# EAGLE design ME433_chip_board (EAGLE 6.5.0)
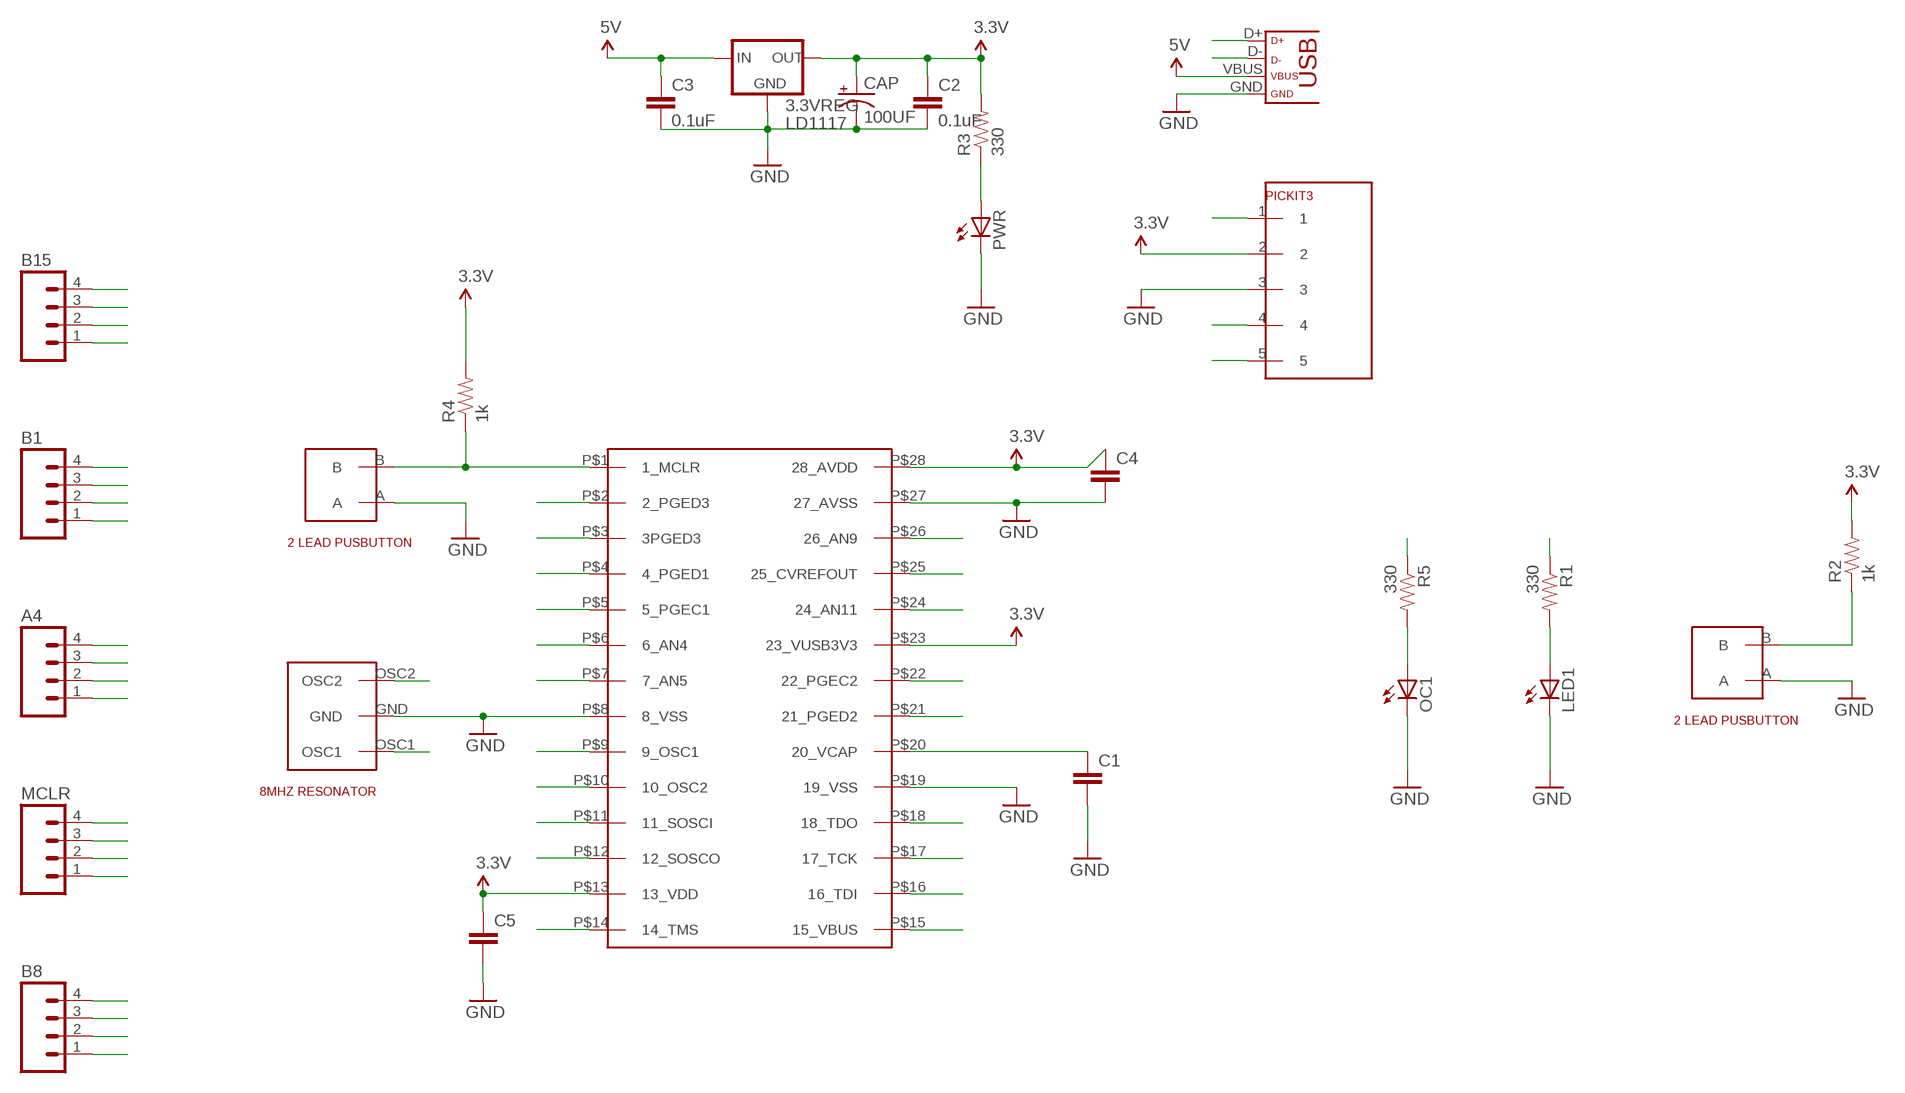
[diagram p0: schematic, sheet 1]

## Parts
3.3VREG  LD1117  [TO220]
A4  M04PTH  [1X04]
B1  M04PTH  [1X04]
B8  M04PTH  [1X04]
B15  M04PTH  [1X04]
C1  CAP0603-CAP  [0603-CAP]
C2  0.1uF  CAP0603-CAP  [0603-CAP]
C3  0.1uF  CAP0603-CAP  [0603-CAP]
C4  CAP0603-CAP  [0603-CAP]
C5  CAP0603-CAP  [0603-CAP]
CAP  100UF  CAP_POL  [CAP_POL_D]
LED1  TLLR4400  [LED3MM]
MCLR  M04PTH  [1X04]
OC1  TLLR4400  [LED3MM]
PICKIT3  1X05_HEADER  [1X05]
PWR  TLLY4400  [LED3MM]
R1  330  RESISTOR0603  [0603-RES]
R2  1k  RESISTOR0603  [0603-RES]
R3  330  RESISTOR0603  [0603-RES]
R4  1k  RESISTOR0603  [0603-RES]
R5  330  RESISTOR0603  [0603-RES]
U$1  PIC32MX250F128B  [PIC32MX250F128B]
U$3  2LEAD_PUSHBUTTON  [2LEAD_PUSHBUTTON]
U$6  8MHZ_RESONATOR  [8MHZ_RESONATOR]
U$7  2LEAD_PUSHBUTTON  [2LEAD_PUSHBUTTON]
USB  USB  [USB-MINIB]

## Nets
3.3V: 3.3VREG.2(OUT) A4.1 C2.1 C4.1 C5.1 CAP.1(+) PICKIT3.2 R2.2 R3.2 R4.2 U$1.P$13(13_VDD) U$1.P$23(23_VUSB3V3) U$1.P$28(28_AVDD)
5V: 3.3VREG.3(IN) B8.1 C3.1 U$1.P$15(15_VBUS) USB.VBUS
A0: B15.3 U$1.P$2(2_PGED3)
A1: B15.2 U$1.P$3(3PGED3)
A4: A4.4 U$1.P$12(12_SOSCO)
B0: B15.1 PICKIT3.4 U$1.P$4(4_PGED1)
B1: B1.4 PICKIT3.5 U$1.P$5(5_PGEC1)
B2: B1.3 U$1.P$6(6_AN4)
B3: B1.2 U$1.P$7(7_AN5)
B4: B1.1 U$1.P$11(11_SOSCI)
B5: A4.3 U$1.P$14(14_TMS)
B7: B8.3 R1.1 U$1.P$16(16_TDI)
B8: B8.4 U$1.P$17(17_TCK)
B9: MCLR.1 U$1.P$18(18_TDO)
B13: MCLR.2 R2.1 U$1.P$24(24_AN11) U$7.B
B14: MCLR.3 U$1.P$25(25_CVREFOUT)
B15: MCLR.4 R5.1 U$1.P$26(26_AN9)
D+: U$1.P$21(21_PGED2) USB.D+
D-: U$1.P$22(22_PGEC2) USB.D-
GND: 3.3VREG.1(GND) A4.2 B8.2 C1.2 C2.2 C3.2 C4.2 C5.2 CAP.2(-) LED1.K(C) OC1.K(C) PICKIT3.3 PWR.K(C) U$1.P$8(8_VSS) U$1.P$19(19_VSS) U$1.P$27(27_AVSS) U$3.A U$6.GND U$7.A USB.GND
MCLR: B15.4 PICKIT3.1 R4.1 U$1.P$1(1_MCLR) U$3.B
N$1: LED1.A R1.2
N$3: OC1.A R5.2
N$4: PWR.A R3.1
N$38: C1.1 U$1.P$20(20_VCAP)
OSC1: U$1.P$9(9_OSC1) U$6.OSC1
OSC2: U$1.P$10(10_OSC2) U$6.OSC2

## Library data of the parts
3.3VREG = ME433:LD1117
A4 B1 B8 B15 MCLR = SparkFun-Connectors:M04: Header 4 Standard 4-pin 0.1" header. Use with straight break away headers (SKU : PRT-00116), right angle break away headers (PRT-00553), swiss pins (PRT-00743), machine pins (PRT-00117), and female headers (PRT-00115). Molex polarized connector foot print use with SKU : PRT-08231 with associated crimp pins and housings. 1MM SMD Version SKU: PRT-10208
C1-C5 = ME433:CAP: Capacitor Standard 0603 ceramic capacitor, and 0.1" leaded capacitor.
CAP = ME433:CAP_POL
LED1 OC1 = ME433:TLLR4400: Low Current (2mA) LED 3 mm Tinted Diffused Package color RED Source: Data sheet <http://www.farnell.com/datasheets/391100.pdf>; MF: VISHAY SEMICONDUCTOR; OC_FARNELL: 1612437
PICKIT3 = ME433:1X05_HEADER
PWR = ME433:TLLY4400: Low Current (2mA) LED 3 mm Tinted Diffused Package color YELLOW Source: Data sheet <http://www.farnell.com/datasheets/391098.pdf>; MF: VISHAY SEMICONDUCTOR; OC_FARNELL: 1612439
R1-R5 = SparkFun-Resistors:RESISTOR: Resistor Basic schematic elements and footprints for 0603, 1206, and PTH resistors.
U$1 = ME433:PIC32MX250F128B
U$3 U$7 = ME433:2LEAD_PUSHBUTTON
U$6 = ME433:8MHZ_RESONATOR
USB = ME433:USB

## Board
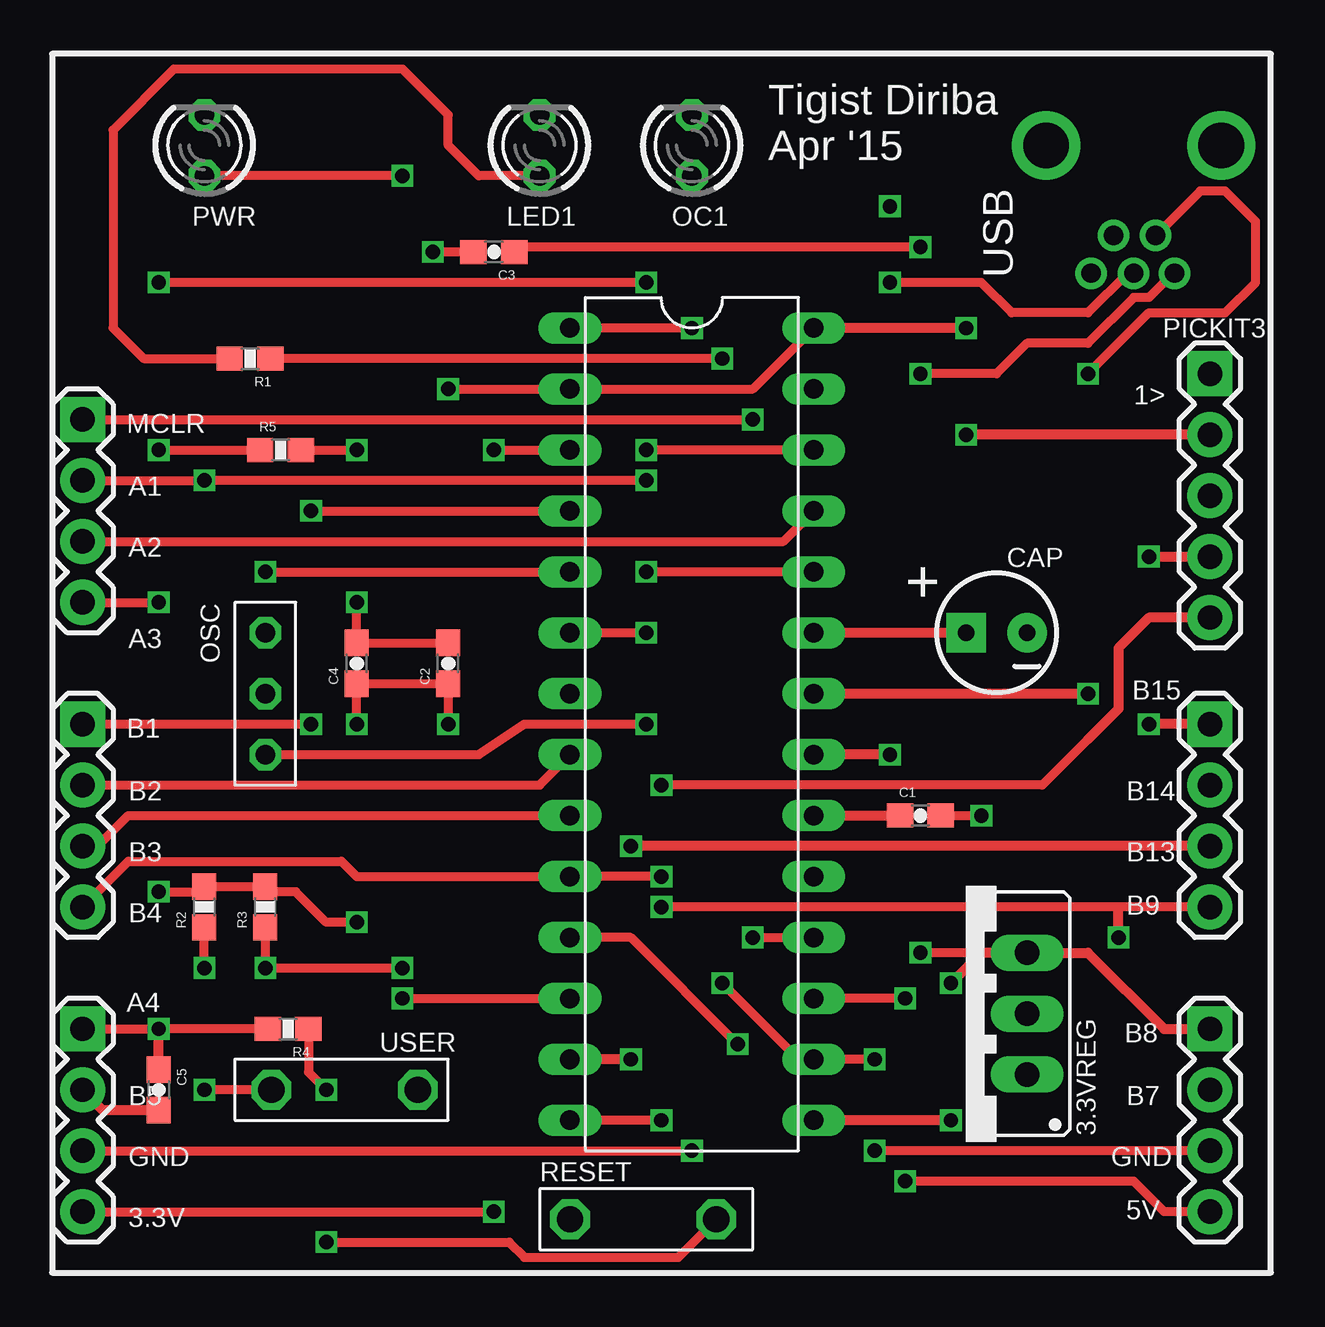
[diagram p1: board, top side]
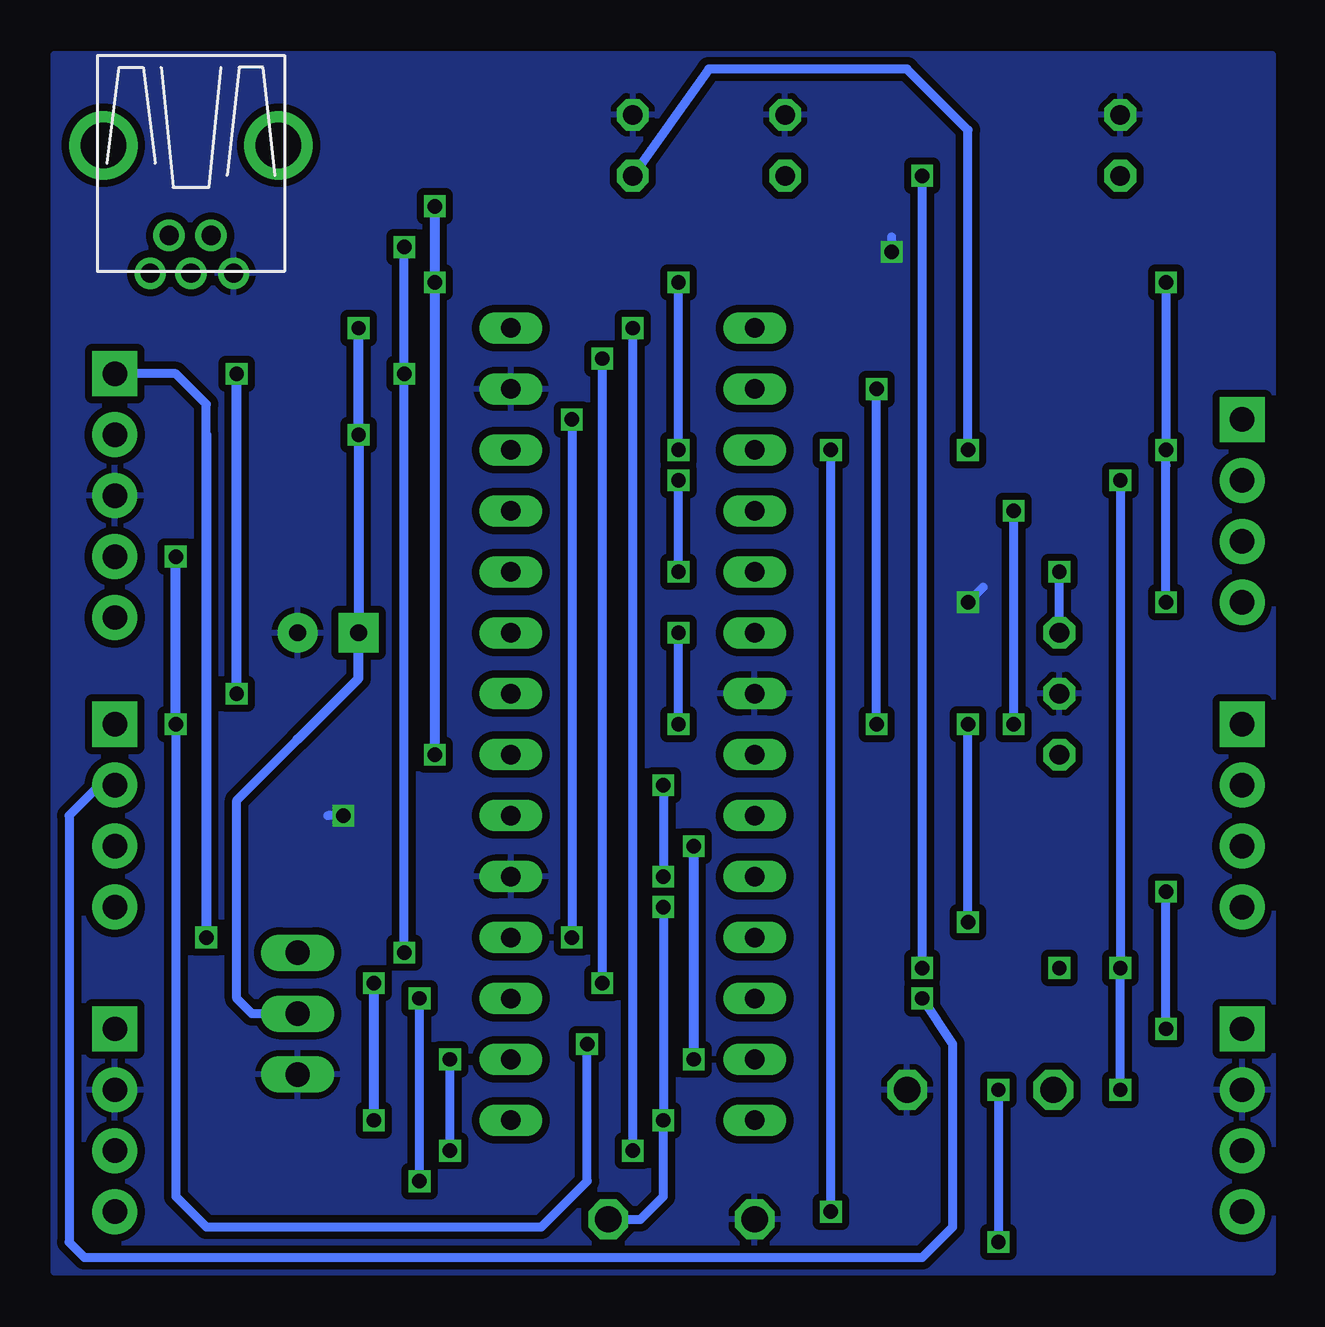
[diagram p2: board, bottom side, seen from below]

No outline drawn. Coordinates in mm, seen from the top.
Copper layers (1*16): Top 0.035mm / dielectric 1.5mm / Bottom 0.035mm
Design rules "SeeedStudio_2layer_DRU_no_angle_20140221": minimum track width 6mil, minimum drill 12mil, track to track 6mil, track to pad 6mil, pad to pad 6mil, via to via 6mil, smd to smd 0mil, copper to edge 10mil, drill to drill 10mil, minimum pad ring 10mil, minimum via ring 6mil, stop-mask expansion 2mil, vias tented up to drill 100mil, thermal gap 10mil

### Footprints (pad centres in the part's own frame; a part is rotated, then mirrored left to right if it is on the bottom)
TO220 = drill 1.016 long: 1 -2.54,0; 2 0,0; 3 2.54,0
1X04 = drill 1.016 pad 1.88 square: 1 0,0 | drill 1.016 pad 1.88: 2 2.54,0; 3 5.08,0; 4 7.62,0
0603-CAP = smd 1.1 x 1: 1 -0.85,0; 2 0.85,0
CAP_POL_D = drill 0.7 pad 1.651 square: 1 1.27,0 | drill 0.7 pad 1.651: 2 -1.27,0
LED3MM = drill 0.813 octagon: A -1.27,0; K 1.27,0
1X05 = drill 1.016 pad 1.88 square: 1 0,0 | drill 1.016 pad 1.88: 2 2.54,0; 3 5.08,0; 4 7.62,0; 5 10.16,0
0603-RES = smd 1.1 x 1: 1 -0.85,0; 2 0.85,0
PIC32MX250F128B = drill 0.813 long: P$1 0,0; P$2 0,2.54; P$3 0,5.08; P$4 0,7.62; P$5 0,10.16; P$6 0,12.7; P$7 0,15.24; P$8 0,17.78; P$9 0,20.32; P$10 0,22.86; P$11 0,25.4; P$12 0,27.94; P$13 0,30.48; P$14 0,33.02; P$15 10.16,0; P$16 10.16,2.54; P$17 10.16,5.08; P$18 10.16,7.62; P$19 10.16,10.16; P$20 10.16,12.7; P$21 10.16,15.24; P$22 10.16,17.78; P$23 10.16,20.32; P$24 10.16,22.86; P$25 10.16,25.4; P$26 10.16,27.94; P$27 10.16,30.48; P$28 10.16,33.02
2LEAD_PUSHBUTTON = drill 1.1 octagon: A 0,0; B 6.1,0
8MHZ_RESONATOR = drill 0.813 octagon: GND 2.54,0; OSC1 0,0; OSC2 5.08,0
USB-MINIB = drill 0.8: D+ 4.064,0; D- 2.489,0.914; GND 4.064,-1.778; ID 2.489,-0.838; VBUS 4.064,1.702 | drill 1.9: P$6 -1.27,-3.65; P$7 -1.27,3.65

### Placement (x,y rotation side)
3.3VREG  40.64,10.79 90 top
A4  1.27,10.16 270 top
B1  1.27,22.86 270 top
B8  48.26,10.16 270 top
B15  48.26,22.86 270 top
C1  36.2,19.05 0 top
C2  16.51,25.4 90 top
C3  18.41,42.55 180 top
C4  12.7,25.4 90 top
C5  4.45,7.62 270 top
CAP  39.37,26.67 180 top
LED1  20.32,46.99 90 top
MCLR  1.27,35.56 270 top
OC1  26.67,46.99 90 top
PICKIT3  48.26,37.47 270 top
PWR  6.35,46.99 90 top
R1  8.26,38.1 180 top
R2  6.35,15.24 90 top
R3  8.89,15.24 90 top
R4  9.84,10.16 180 top
R5  9.53,34.29 0 top
U$1  21.59,6.35 0 top
U$3  21.59,2.22 0 top
U$6  8.89,21.59 90 top
U$7  15.24,7.62 180 top
USB  45.09,45.72 270 top

### Tracks (layer width: path | path; a pad name or v marks a point on that pad's centre or on a via)
3.3V  (via drill 0.6)
  Top 0.381: A4.1 v4.45,10.16 R4.2 | v4.45,15.88 6.35,15.88 R2.2 R3.2 9.11,15.88 10.16,15.88 11.43,14.61 v12.7,14.61 | v12.7,22.86 C4.1 C2.1 v16.51,22.86 | v16.51,36.83 U$1.P$13 29.21,36.83 U$1.P$28
  Top 0.406: PICKIT3.2 v38.1,34.92 | v38.1,39.37 U$1.P$28 | CAP.1 U$1.P$23 | C5.1 v4.45,10.16
  Bottom 0.381: v4.45,10.16 v4.45,15.88 | v12.7,14.61 v12.7,22.86 | v16.51,22.86 v16.51,36.83 | 3.3VREG.2 42.55,10.79 43.18,11.43 43.18,19.68 40.64,22.23
  Bottom 0.406: v38.1,39.37 v38.1,34.92 CAP.1 38.1,24.77 40.64,22.23
5V  (via drill 0.6)
  Top 0.381: v36.2,42.75 19.47,42.75 C3.1 | 3.3VREG.3 v36.2,13.34 | USB.VBUS 46.74,41.66 45.72,40.64 45.09,40.64 43.18,38.73 40.64,38.73 39.37,37.47 v36.2,37.47
  Top 0.406: B8.1 46.35,10.16 43.18,13.34 3.3VREG.3 38.73,13.34 v37.47,12.06 | v37.47,6.35 U$1.P$15
  Bottom 0.381: v36.2,13.34 v36.2,37.47 v36.2,42.75
  Bottom 0.406: v37.47,12.06 v37.47,6.35
A0  (via drill 0.6)
  Top 0.406: B15.3 v24.13,17.78 | v24.13,8.89 U$1.P$2
  Bottom 0.406: v24.13,17.78 v24.13,8.89
A1  (via drill 0.6)
  Top 0.381: v14.61,11.43 U$1.P$3
  Bottom 0.381: B15.2 48.9,20.32 50.16,19.05 50.16,1.27 49.53,0.64 14.61,0.64 13.34,1.91 13.34,9.53 v14.61,11.43
A4  (via drill 0.6)
  Top 0.381: A4.4 v18.41,2.54 | v18.41,34.29 U$1.P$12
  Bottom 0.381: v18.41,2.54 v18.41,34.29
B0  (via drill 0.6)
  Top 0.381: v28.57,9.53 24.13,13.97 U$1.P$4
  Top 0.406: B15.1 v45.72,22.86 | v45.72,29.84 PICKIT3.4
  Bottom 0.381: v45.72,22.86 45.72,3.17 44.45,1.91 30.48,1.91 28.57,3.81 v28.57,9.53
  Bottom 0.406: v45.72,22.86 v45.72,29.84
B1  (via drill 0.6)
  Top 0.381: B1.4 3.17,17.14 12.06,17.14 12.7,16.51 U$1.P$5 v25.4,16.51 | 43.18,22.23 41.27,20.32 v25.4,20.32
  Top 0.406: PICKIT3.5 45.72,27.3 44.45,26.04 44.45,23.5 43.18,22.23
  Bottom 0.381: v25.4,20.32 v25.4,16.51
B2
  Top 0.381: U$1.P$6 3.17,19.05 1.91,17.78 B1.3
B3
  Top 0.381: B1.2 20.32,20.32 U$1.P$7
B4  (via drill 0.6)
  Top 0.381: B1.1 v10.79,22.86 | v10.79,31.75 U$1.P$11
  Bottom 0.381: v10.79,22.86 v10.79,31.75
B5  (via drill 0.6)
  Top 0.381: A4.3 v26.67,5.08 | v26.67,39.37 U$1.P$14
  Bottom 0.381: v26.67,5.08 v26.67,39.37
B7  (via drill 0.6)
  Top 0.381: B8.3 v34.29,5.08 | v34.29,8.89 U$1.P$16 31.11,8.89 v27.94,12.06 | v27.94,38.1 R1.1
  Bottom 0.381: v34.29,5.08 v34.29,8.89 | v27.94,12.06 v27.94,38.1
B8  (via drill 0.6)
  Top 0.381: v35.56,11.43 U$1.P$17 | B8.4 46.35,2.54 45.09,3.81 v35.56,3.81
  Bottom 0.381: v35.56,3.81 v35.56,11.43
B9  (via drill 0.6)
  Top 0.381: MCLR.1 v29.21,35.56 | v29.21,13.97 U$1.P$18
  Bottom 0.381: v29.21,35.56 v29.21,13.97
B13  (via drill 0.6)
  Top 0.381: U$7.B v6.35,7.62 | v6.35,12.7 R2.1 | MCLR.2 v6.35,33.02 v24.77,33.02 | U$1.P$24 v24.77,29.21
  Bottom 0.381: v6.35,7.62 v6.35,12.7 v6.35,33.02 | v24.77,29.21 v24.77,33.02
B14
  Top 0.381: MCLR.3 30.48,30.48 U$1.P$25
B15  (via drill 0.6)
  Top 0.381: MCLR.4 v4.45,27.94 | v4.45,34.29 R5.1 | U$1.P$26 v24.77,34.29 | v24.77,41.27 v4.45,41.27
  Bottom 0.381: v4.45,27.94 4.45,33.66 v4.45,34.29 v4.45,41.27 | v24.77,34.29 v24.77,41.27
D+  (via drill 0.6)
  Top 0.381: USB.D+ 44.83,41.66 43.18,40.01 40.01,40.01 38.73,41.27 v34.92,41.27
  Top 0.406: v34.92,21.59 U$1.P$21
  Bottom 0.406: v34.92,44.45 v34.92,41.27 v34.92,21.59
D-  (via drill 0.6)
  Top 0.381: v43.18,37.47 45.72,40.01 48.9,40.01 50.16,41.27 50.16,43.81 48.9,45.09 47.85,45.09 USB.D-
  Top 0.406: U$1.P$22 v43.18,24.13
  Bottom 0.406: v43.18,24.13 v43.18,37.47
GND  (via drill 0.6)
  Top 0.381: C2.2 C4.2 v12.7,27.94 | C1.2 v38.73,19.05 | C3.2 v15.88,42.55
  Top 0.406: C5.2 2.12,6.77 A4.2
  Bottom 0.381: v38.73,19.05 39.37,19.05 | v15.88,42.55 15.88,43.18 | v12.7,27.94 12.06,28.57
  pour Bottom (isolate 0.305): 0,0 50.8,0 50.8,50.8 0,50.8 0,49.53
MCLR  (via drill 0.6)
  Top 0.381: B15.4 44.45,15.24 v25.4,15.24 | v25.4,6.35 U$1.P$1 | R4.1 10.69,8.36 v11.43,7.62 | v11.43,1.27 19.05,1.27 19.68,0.64 26.1,0.64 U$3.B
  Top 0.406: v44.45,13.97 44.45,15.24
  Bottom 0.381: v25.4,15.24 v25.4,6.35 25.4,3.17 26.35,2.22 U$3.B | v11.43,7.62 v11.43,1.27 | 44.45,34.92 44.45,36.2 45.72,37.47 PICKIT3.1
  Bottom 0.406: 44.45,34.92 v44.45,13.97
N$1
  Top 0.381: LED1.A 17.78,45.72 16.51,46.99 16.51,48.26 14.61,50.16 5.08,50.16 2.54,47.62 2.54,39.37 3.81,38.1 R1.2
N$3  (via drill 0.6)
  Top 0.381: R5.2 v12.7,34.29
  Bottom 0.381: v12.7,34.29 12.7,47.62 15.24,50.16 23.5,50.16 OC1.A
N$4  (via drill 0.6)
  Top 0.381: R3.1 v8.89,12.7 v14.61,12.7 | v14.61,45.72 PWR.A
  Bottom 0.381: v14.61,12.7 v14.61,45.72
N$38
  Top 0.406: U$1.P$20 C1.1
OSC1  (via drill 0.6)
  Top 0.381: U$6.OSC1 17.78,21.59 19.68,22.86 v24.77,22.86 | v24.77,26.67 U$1.P$9
  Bottom 0.381: v24.77,22.86 v24.77,26.67
OSC2  (via drill 0.6)
  Top 0.381: v8.89,29.21 U$1.P$10
  Bottom 0.381: U$6.OSC2 v8.89,29.21

### Text on the board
tPlace: Tigist Diriba | Apr '15 | 1> | A1 | A2 | + | A3 | OSC | B2 | B14 | B3 | B13 | B4 | B9 | USER | B5 | B7 | GND | RESET | GND | 3.3V | 5V